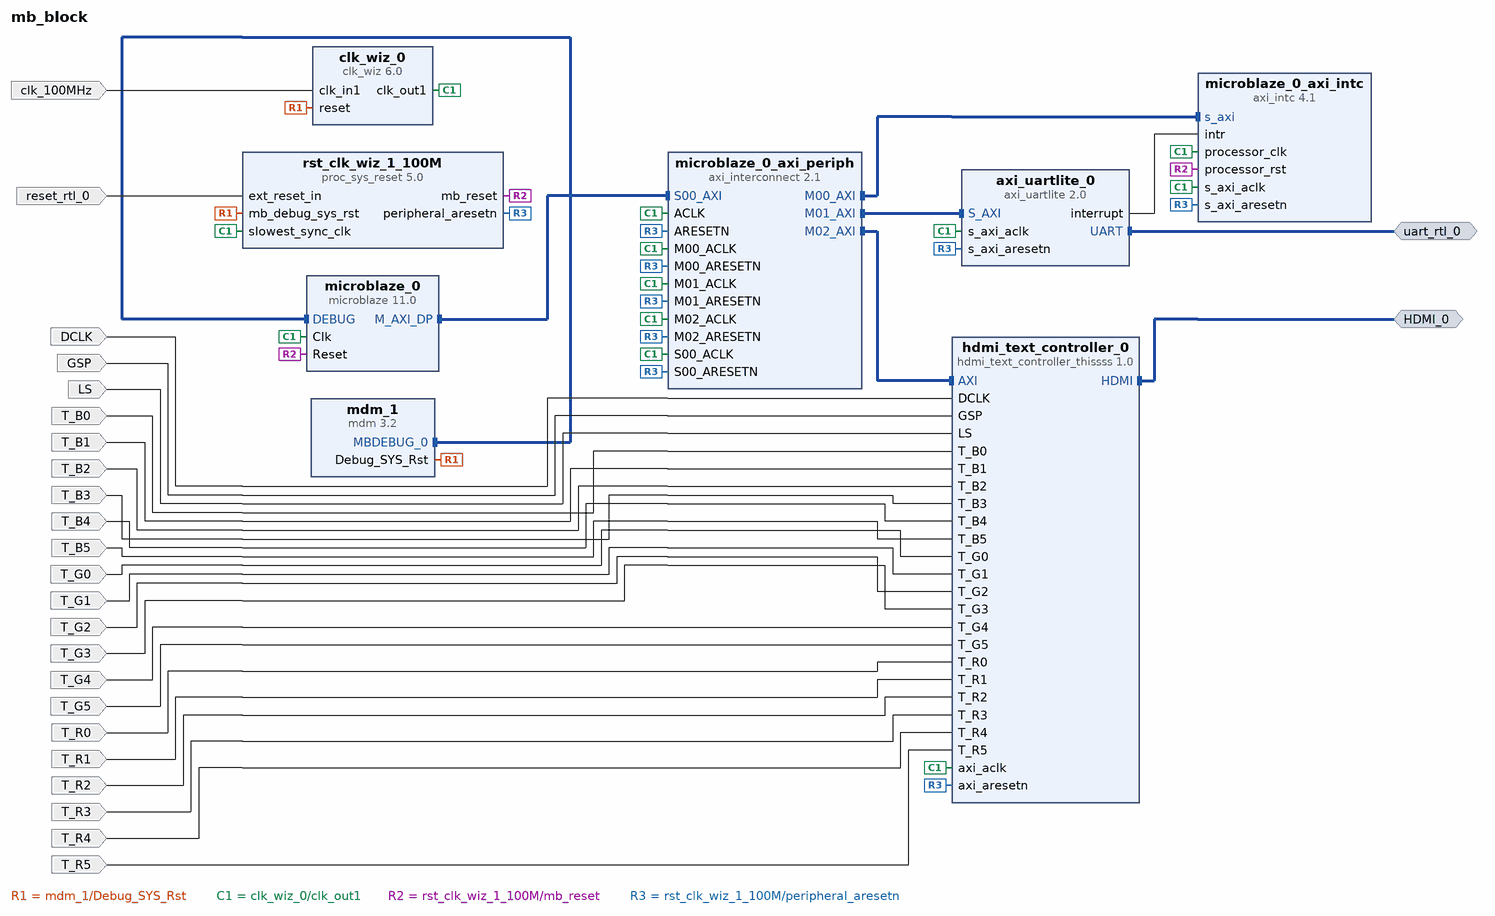
[diagram p0: block diagram of the top level]
# Vivado block design mb_block, xc7s50csga324-1, Vivado 2022.2
create_bd_design mb_block

create_bd_intf_port -mode Master -vlnv xilinx.com:interface:uart_rtl:1.0 uart_rtl_0
create_bd_intf_port -mode Master -vlnv xilinx.com:interface:hdmi_rtl:2.0 HDMI_0
create_bd_port -dir I -type clk clk_100MHz
set_property -dict {CONFIG.FREQ_HZ 100000000} [get_bd_ports clk_100MHz]
create_bd_port -dir I -type rst reset_rtl_0
set_property -dict {CONFIG.POLARITY ACTIVE_LOW} [get_bd_ports reset_rtl_0]
create_bd_port -dir I T_R0
create_bd_port -dir I T_R1
create_bd_port -dir I GSP
create_bd_port -dir I T_G2
create_bd_port -dir I T_G1
create_bd_port -dir I T_G4
create_bd_port -dir I T_G3
create_bd_port -dir I T_B0
create_bd_port -dir I T_G5
create_bd_port -dir I T_R2
create_bd_port -dir I T_B2
create_bd_port -dir I T_B1
create_bd_port -dir I T_R4
create_bd_port -dir I T_B4
create_bd_port -dir I T_B3
create_bd_port -dir I T_R3
create_bd_port -dir I T_G0
create_bd_port -dir I DCLK
create_bd_port -dir I T_B5
create_bd_port -dir I T_R5
create_bd_port -dir I LS

create_bd_cell -type ip -vlnv xilinx.com:ip:axi_interconnect:2.1 microblaze_0_axi_periph
set_property -dict {CONFIG.NUM_MI 3} [get_bd_cells microblaze_0_axi_periph]
create_bd_cell -type ip -vlnv xilinx.com:ip:axi_intc:4.1 microblaze_0_axi_intc
set_property -dict {CONFIG.C_HAS_FAST 1} [get_bd_cells microblaze_0_axi_intc]
create_bd_cell -type ip -vlnv xilinx.com:ip:mdm:3.2 mdm_1
create_bd_cell -type ip -vlnv xilinx.com:ip:proc_sys_reset:5.0 rst_clk_wiz_1_100M
create_bd_cell -type ip -vlnv xilinx.com:ip:clk_wiz:6.0 clk_wiz_0
set_property -dict [list \
  CONFIG.CLKOUT1_JITTER 130.958 \
  CONFIG.CLKOUT1_PHASE_ERROR 98.575 \
  CONFIG.CLKOUT1_REQUESTED_OUT_FREQ 100 \
  CONFIG.CLKOUT2_JITTER 125.247 \
  CONFIG.CLKOUT2_PHASE_ERROR 98.575 \
  CONFIG.CLKOUT2_REQUESTED_OUT_FREQ 125 \
  CONFIG.CLKOUT2_USED false \
  CONFIG.MMCM_CLKFBOUT_MULT_F 10.000 \
  CONFIG.MMCM_CLKOUT0_DIVIDE_F 10.000 \
  CONFIG.MMCM_CLKOUT1_DIVIDE 1 \
  CONFIG.NUM_OUT_CLKS 1 \
] [get_bd_cells clk_wiz_0]
create_bd_cell -type ip -vlnv xilinx.com:ip:axi_uartlite:2.0 axi_uartlite_0
set_property -dict {CONFIG.C_BAUDRATE 115200} [get_bd_cells axi_uartlite_0]
create_bd_cell -type ip -vlnv xilinx.com:ip:microblaze:11.0 microblaze_0
set_property -dict {CONFIG.C_DEBUG_ENABLED 1 CONFIG.C_D_AXI 1 CONFIG.C_D_LMB 0 CONFIG.C_I_LMB 0} [get_bd_cells microblaze_0]
create_bd_cell -type ip -vlnv xilinx.com:user:hdmi_text_controller_thissss:1.0 hdmi_text_controller_0

# ---- connections ----

connect_bd_intf_net [get_bd_intf_ports uart_rtl_0] [get_bd_intf_pins axi_uartlite_0/UART]
connect_bd_intf_net [get_bd_intf_ports HDMI_0] [get_bd_intf_pins hdmi_text_controller_0/HDMI]
connect_bd_intf_net [get_bd_intf_pins microblaze_0/M_AXI_DP] [get_bd_intf_pins microblaze_0_axi_periph/S00_AXI]
connect_bd_intf_net [get_bd_intf_pins microblaze_0_axi_periph/M01_AXI] [get_bd_intf_pins axi_uartlite_0/S_AXI]
connect_bd_intf_net [get_bd_intf_pins microblaze_0_axi_periph/M02_AXI] [get_bd_intf_pins hdmi_text_controller_0/AXI]
connect_bd_intf_net [get_bd_intf_pins mdm_1/MBDEBUG_0] [get_bd_intf_pins microblaze_0/DEBUG]
connect_bd_intf_net -intf_net microblaze_0_intc_axi [get_bd_intf_pins microblaze_0_axi_periph/M00_AXI] [get_bd_intf_pins microblaze_0_axi_intc/s_axi]
connect_bd_net [get_bd_ports DCLK] [get_bd_pins hdmi_text_controller_0/DCLK]
connect_bd_net [get_bd_ports GSP] [get_bd_pins hdmi_text_controller_0/GSP]
connect_bd_net [get_bd_ports LS] [get_bd_pins hdmi_text_controller_0/LS]
connect_bd_net -net T_B0_1 [get_bd_ports T_B0] [get_bd_pins hdmi_text_controller_0/T_B0]
connect_bd_net -net T_B1_1 [get_bd_ports T_B1] [get_bd_pins hdmi_text_controller_0/T_B1]
connect_bd_net -net T_B2_1 [get_bd_ports T_B2] [get_bd_pins hdmi_text_controller_0/T_B2]
connect_bd_net -net T_B3_1 [get_bd_ports T_B3] [get_bd_pins hdmi_text_controller_0/T_B3]
connect_bd_net -net T_B4_1 [get_bd_ports T_B4] [get_bd_pins hdmi_text_controller_0/T_B4]
connect_bd_net -net T_B5_1 [get_bd_ports T_B5] [get_bd_pins hdmi_text_controller_0/T_B5]
connect_bd_net -net T_G0_1 [get_bd_ports T_G0] [get_bd_pins hdmi_text_controller_0/T_G0]
connect_bd_net -net T_G1_1 [get_bd_ports T_G1] [get_bd_pins hdmi_text_controller_0/T_G1]
connect_bd_net -net T_G2_1 [get_bd_ports T_G2] [get_bd_pins hdmi_text_controller_0/T_G2]
connect_bd_net -net T_G3_1 [get_bd_ports T_G3] [get_bd_pins hdmi_text_controller_0/T_G3]
connect_bd_net -net T_G4_1 [get_bd_ports T_G4] [get_bd_pins hdmi_text_controller_0/T_G4]
connect_bd_net -net T_G5_1 [get_bd_ports T_G5] [get_bd_pins hdmi_text_controller_0/T_G5]
connect_bd_net -net T_R0_1 [get_bd_ports T_R0] [get_bd_pins hdmi_text_controller_0/T_R0]
connect_bd_net -net T_R1_1 [get_bd_ports T_R1] [get_bd_pins hdmi_text_controller_0/T_R1]
connect_bd_net -net T_R2_1 [get_bd_ports T_R2] [get_bd_pins hdmi_text_controller_0/T_R2]
connect_bd_net -net T_R3_1 [get_bd_ports T_R3] [get_bd_pins hdmi_text_controller_0/T_R3]
connect_bd_net -net T_R4_1 [get_bd_ports T_R4] [get_bd_pins hdmi_text_controller_0/T_R4]
connect_bd_net -net T_R5_1 [get_bd_ports T_R5] [get_bd_pins hdmi_text_controller_0/T_R5]
connect_bd_net [get_bd_pins axi_uartlite_0/interrupt] [get_bd_pins microblaze_0_axi_intc/intr]
connect_bd_net [get_bd_ports clk_100MHz] [get_bd_pins clk_wiz_0/clk_in1]
connect_bd_net [get_bd_pins mdm_1/Debug_SYS_Rst] [get_bd_pins rst_clk_wiz_1_100M/mb_debug_sys_rst] [get_bd_pins clk_wiz_0/reset]
connect_bd_net -net microblaze_0_Clk [get_bd_pins clk_wiz_0/clk_out1] \
  [get_bd_pins microblaze_0_axi_periph/ACLK] [get_bd_pins microblaze_0_axi_periph/S00_ACLK] \
  [get_bd_pins microblaze_0_axi_periph/M00_ACLK] [get_bd_pins microblaze_0_axi_intc/s_axi_aclk] \
  [get_bd_pins microblaze_0_axi_intc/processor_clk] [get_bd_pins rst_clk_wiz_1_100M/slowest_sync_clk] \
  [get_bd_pins microblaze_0_axi_periph/M01_ACLK] [get_bd_pins microblaze_0_axi_periph/M02_ACLK] \
  [get_bd_pins axi_uartlite_0/s_axi_aclk] [get_bd_pins microblaze_0/Clk] [get_bd_pins hdmi_text_controller_0/axi_aclk]
connect_bd_net -net reset_rtl_0_1 [get_bd_ports reset_rtl_0] [get_bd_pins rst_clk_wiz_1_100M/ext_reset_in]
connect_bd_net [get_bd_pins rst_clk_wiz_1_100M/mb_reset] [get_bd_pins microblaze_0_axi_intc/processor_rst] [get_bd_pins microblaze_0/Reset]
connect_bd_net [get_bd_pins rst_clk_wiz_1_100M/peripheral_aresetn] \
  [get_bd_pins microblaze_0_axi_periph/ARESETN] [get_bd_pins microblaze_0_axi_periph/S00_ARESETN] \
  [get_bd_pins microblaze_0_axi_periph/M00_ARESETN] [get_bd_pins microblaze_0_axi_intc/s_axi_aresetn] \
  [get_bd_pins microblaze_0_axi_periph/M01_ARESETN] [get_bd_pins microblaze_0_axi_periph/M02_ARESETN] \
  [get_bd_pins axi_uartlite_0/s_axi_aresetn] [get_bd_pins hdmi_text_controller_0/axi_aresetn]

# ---- address map ----
assign_bd_address -offset 0x40600000 -range 64K -target_address_space [get_bd_addr_spaces microblaze_0/Data] [get_bd_addr_segs axi_uartlite_0/S_AXI/Reg]
assign_bd_address -offset 0x41200000 -range 64K -target_address_space [get_bd_addr_spaces microblaze_0/Data] [get_bd_addr_segs microblaze_0_axi_intc/S_AXI/Reg]
assign_bd_address -offset 0x44A00000 -range 64K -target_address_space [get_bd_addr_spaces microblaze_0/Data] [get_bd_addr_segs hdmi_text_controller_0/AXI/AXI_reg]

validate_bd_design
save_bd_design
